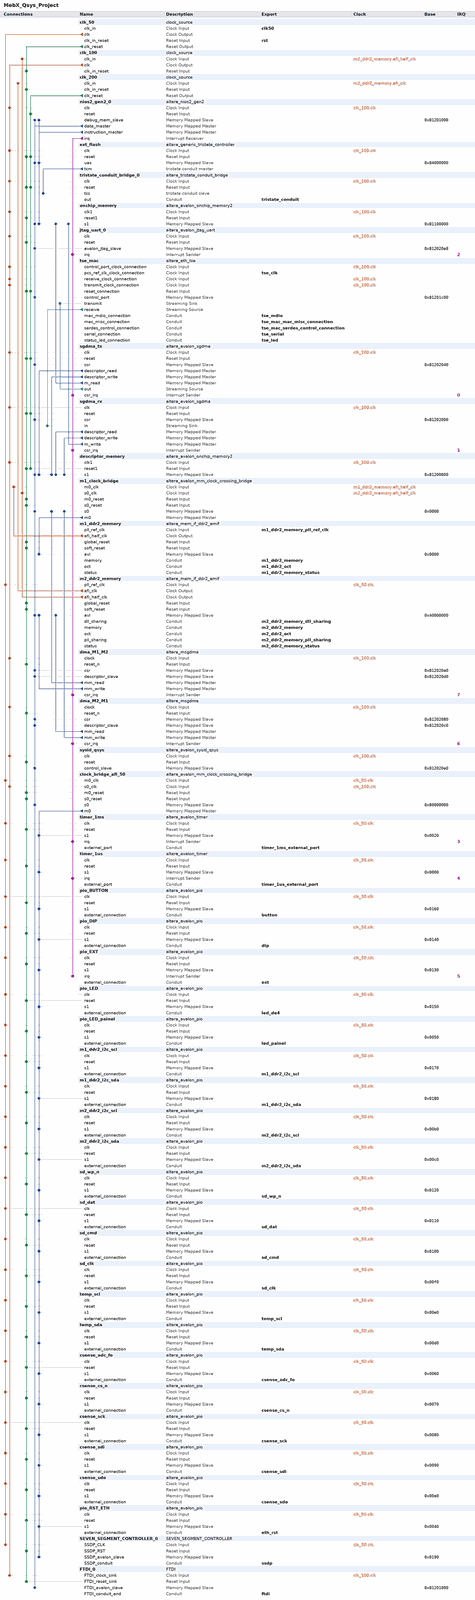
[diagram p0: system contents, whole]
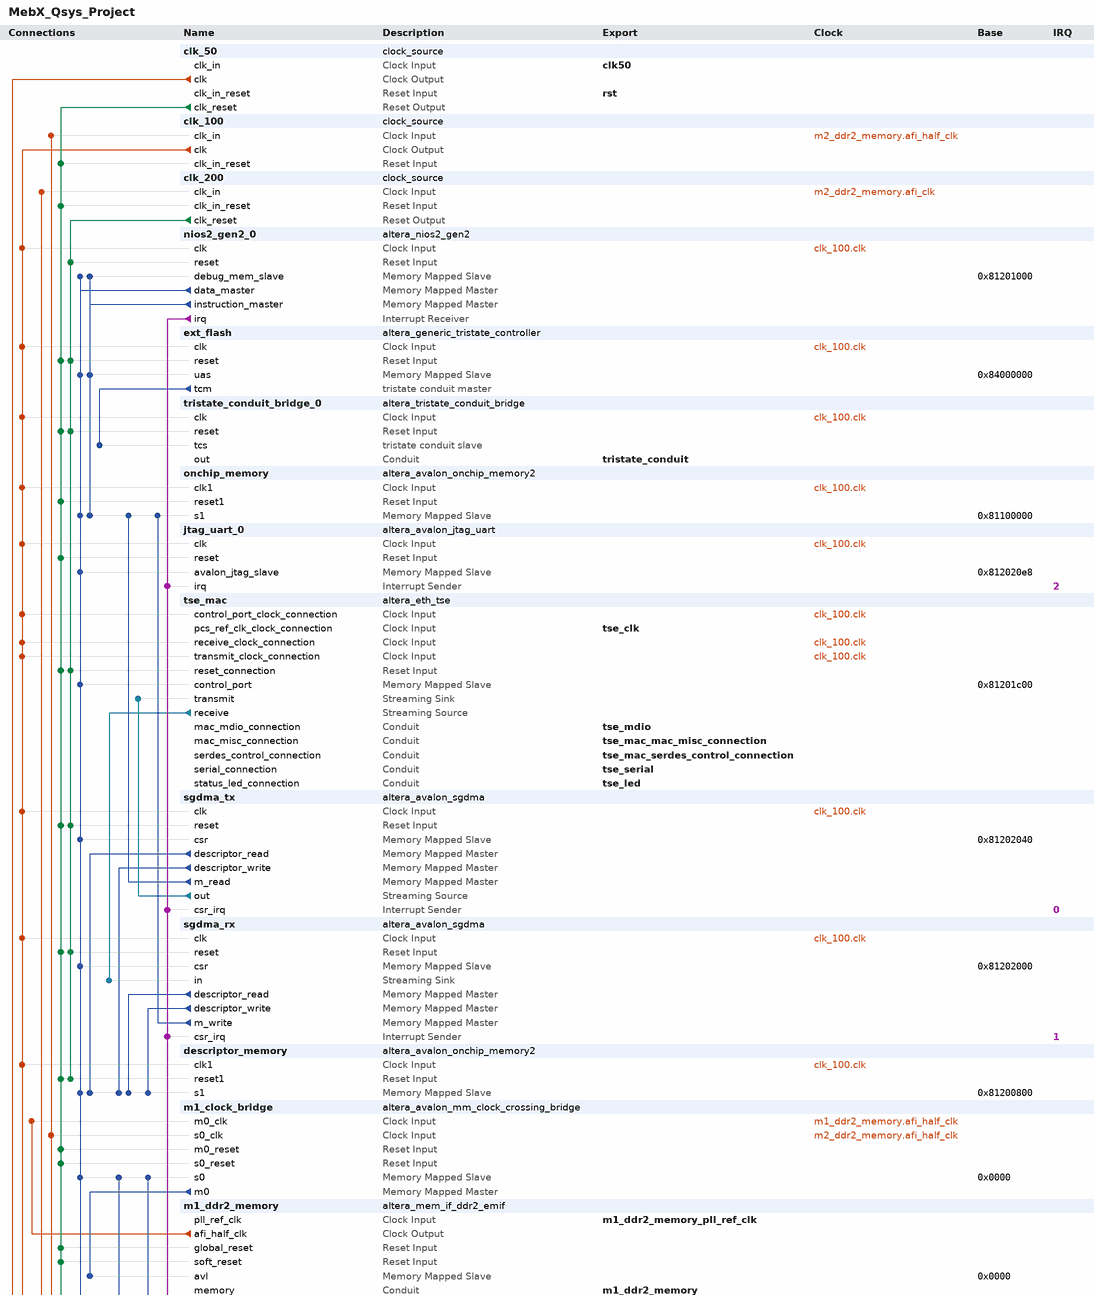
[diagram p1: system contents, upper part]
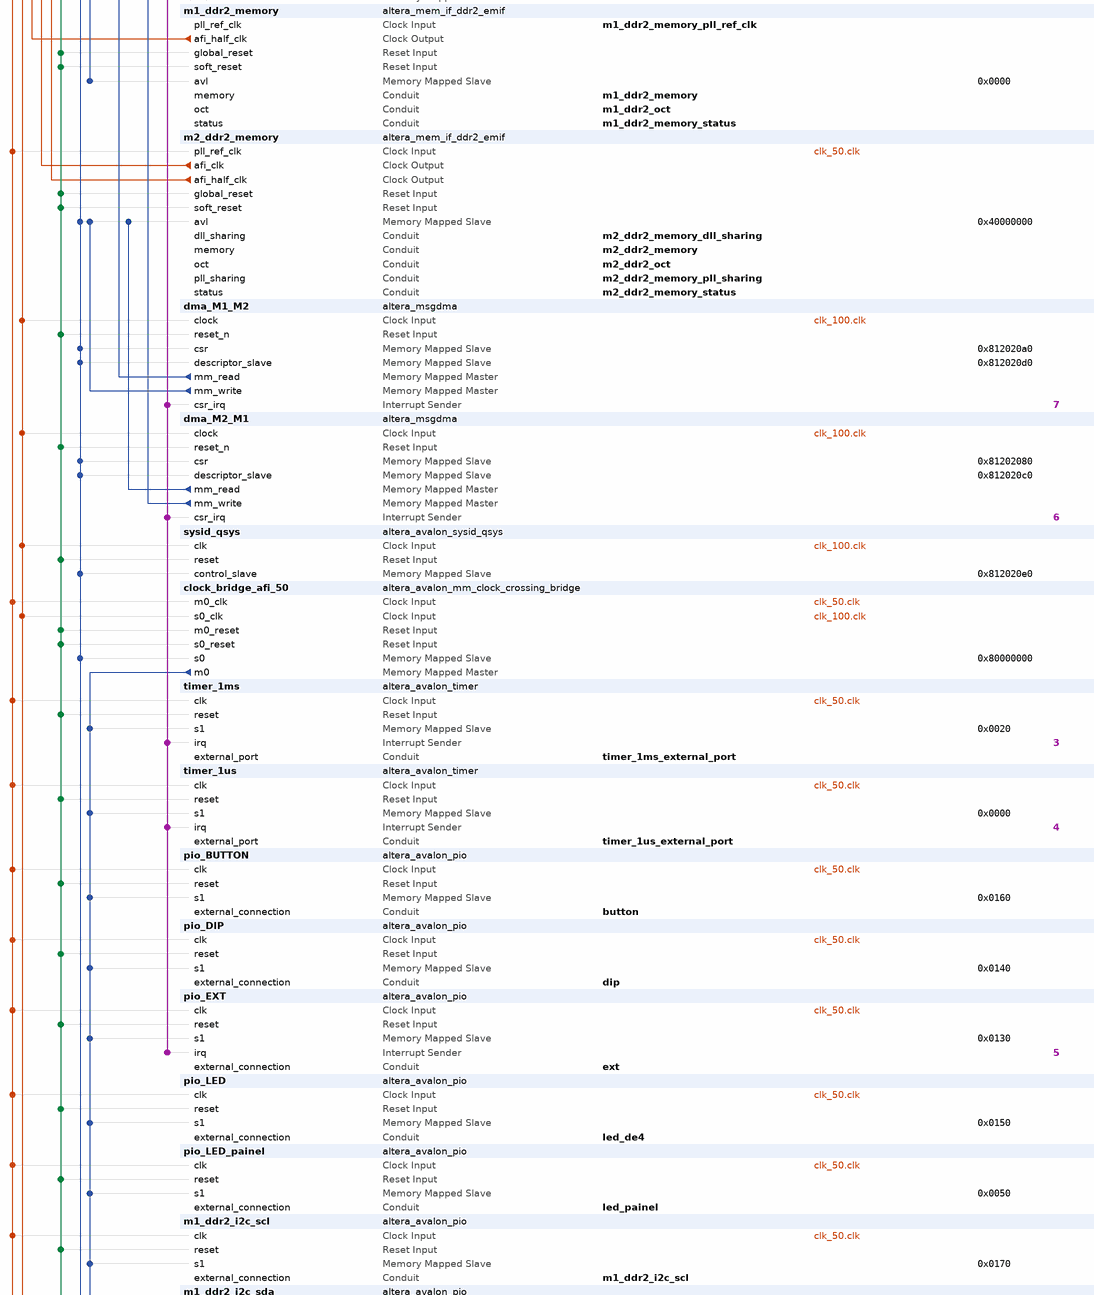
[diagram p2: system contents, middle part]
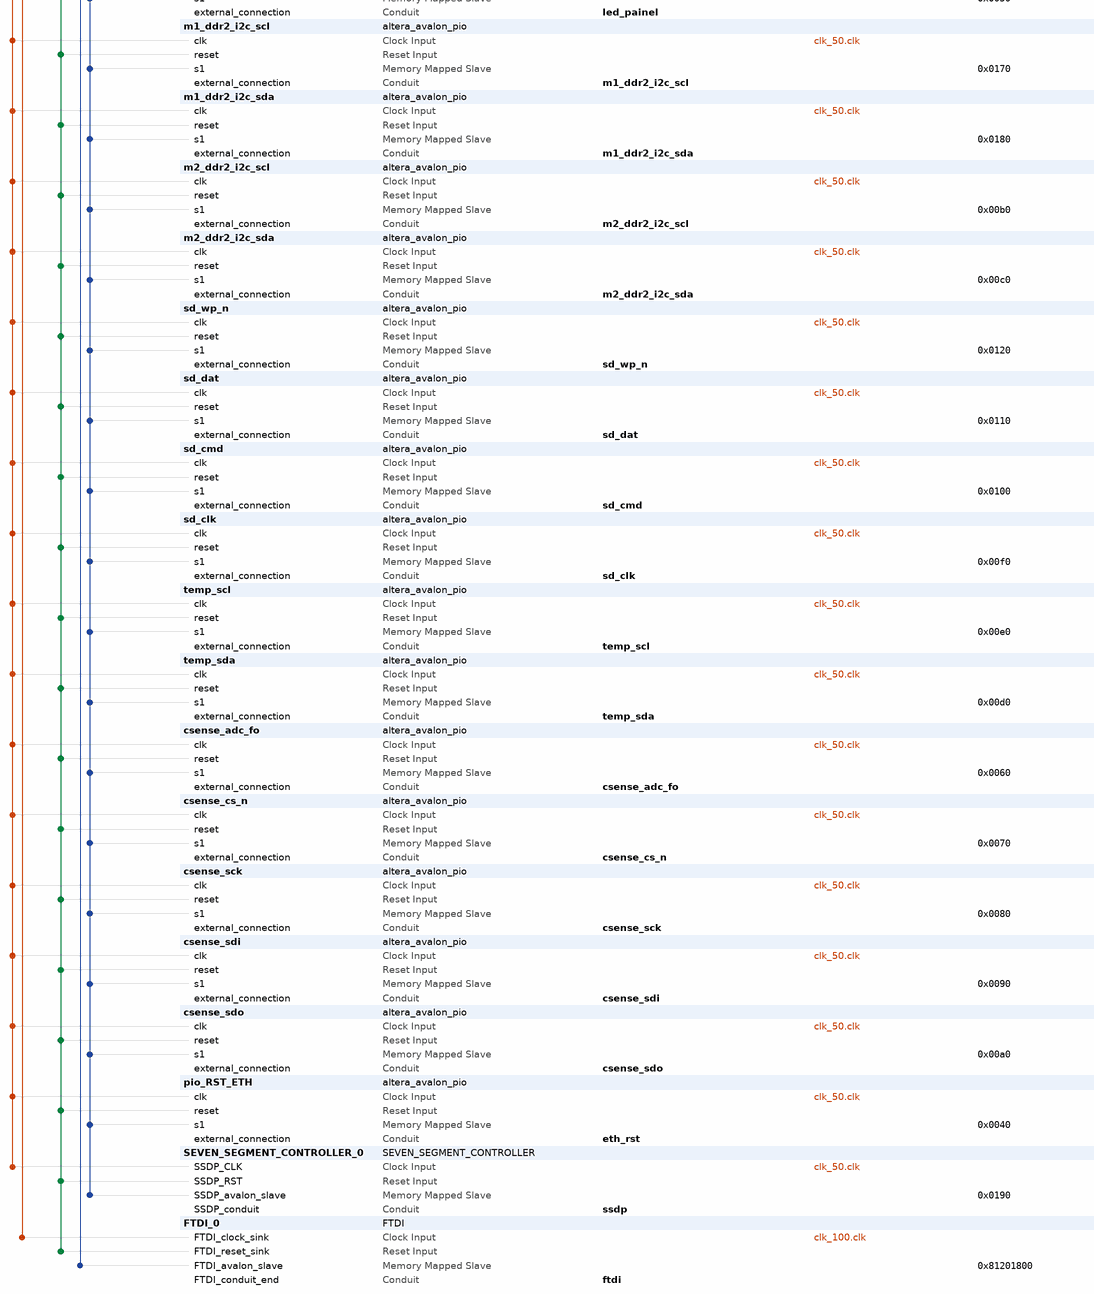
[diagram p3: system contents, lower part]
# Platform Designer (Qsys) system MebX_Qsys_Project, Stratix IV EP4SGX230KF40C2
# Parameters at their usual value, and those the tool derives, are not listed.
package require -exact qsys 16.1
create_system MebX_Qsys_Project
set_project_property DEVICE_FAMILY {Stratix IV}
set_project_property DEVICE EP4SGX230KF40C2

add_instance clk_50 clock_source 16.1
set_instance_parameter_value clk_50 clockFrequency 50000000

add_instance clk_100 clock_source 16.1
set_instance_parameter_value clk_100 clockFrequency 100000000

add_instance clk_200 clock_source 16.1
set_instance_parameter_value clk_200 clockFrequency 200000000

add_instance nios2_gen2_0 altera_nios2_gen2 16.1
set_instance_parameter_value nios2_gen2_0 dcache_size 0
set_instance_parameter_value nios2_gen2_0 debug_hwbreakpoint 2
set_instance_parameter_value nios2_gen2_0 dividerType srt2
set_instance_parameter_value nios2_gen2_0 exceptionSlave onchip_memory.s1
set_instance_parameter_value nios2_gen2_0 icache_burstType Sequential
set_instance_parameter_value nios2_gen2_0 icache_size 4096
set_instance_parameter_value nios2_gen2_0 impl Fast
set_instance_parameter_value nios2_gen2_0 mul_64_impl 1
set_instance_parameter_value nios2_gen2_0 mul_shift_choice 1
set_instance_parameter_value nios2_gen2_0 resetOffset 33685504
set_instance_parameter_value nios2_gen2_0 resetSlave ext_flash.uas
set_instance_parameter_value nios2_gen2_0 setting_support31bitdcachebypass false

add_instance ext_flash altera_generic_tristate_controller 16.1
set_instance_parameter_value ext_flash ACTIVE_LOW_BEGINTRANSFER 0
set_instance_parameter_value ext_flash ACTIVE_LOW_BYTEENABLE 0
set_instance_parameter_value ext_flash ACTIVE_LOW_OUTPUTENABLE 0
set_instance_parameter_value ext_flash ACTIVE_LOW_READ 1
set_instance_parameter_value ext_flash CHIPSELECT_THROUGH_READLATENCY 0
set_instance_parameter_value ext_flash INTERFACE_ASSIGNMENT_KEYS embeddedsw.configuration.isFlash,embeddedsw.configuration.isNonVolatileStorage,embeddedsw.configuration.isMemoryDevice
set_instance_parameter_value ext_flash INTERFACE_ASSIGNMENT_VALUES 1,1,1
set_instance_parameter_value ext_flash MODULE_ASSIGNMENT_KEYS embeddedsw.configuration.hwClassnameDriverSupportList,embeddedsw.configuration.hwClassnameDriverSupportDefault,embeddedsw.CMacro.SETUP_VALUE,embeddedsw.CMacro.WAIT_VALUE,embeddedsw.CMacro.HOLD_VALUE,embeddedsw.CMacro.TIMING_UNITS,embeddedsw.CMacro.SIZE,embeddedsw.memoryInfo.MEM_INIT_DATA_WIDTH,embeddedsw.memoryInfo.HAS_BYTE_LANE,embeddedsw.memoryInfo.IS_FLASH,embeddedsw.memoryInfo.GENERATE_DAT_SYM,embeddedsw.memoryInfo.GENERATE_FLASH,embeddedsw.memoryInfo.DAT_SYM_INSTALL_DIR,embeddedsw.memoryInfo.FLASH_INSTALL_DIR
set_instance_parameter_value ext_flash MODULE_ASSIGNMENT_VALUES "altera_avalon_lan91c111\\,altera_avalon_cfi_flash,altera_avalon_cfi_flash,25,100,20,\"ns\",33554432u,16,1,1,1,1,SIM_DIR,APP_DIR"
set_instance_parameter_value ext_flash TCM_ADDRESS_W 26
set_instance_parameter_value ext_flash TCM_BYTEENABLE_W 2
set_instance_parameter_value ext_flash TCM_DATA_HOLD 20
set_instance_parameter_value ext_flash TCM_DATA_W 16
set_instance_parameter_value ext_flash TCM_MAX_PENDING_READ_TRANSACTIONS 3
set_instance_parameter_value ext_flash TCM_READLATENCY 2
set_instance_parameter_value ext_flash TCM_READ_WAIT 100
set_instance_parameter_value ext_flash TCM_SETUP_WAIT 25
set_instance_parameter_value ext_flash TCM_SYMBOLS_PER_WORD 2
set_instance_parameter_value ext_flash TCM_TIMING_UNITS 0
set_instance_parameter_value ext_flash TCM_TURNAROUND_TIME 2
set_instance_parameter_value ext_flash TCM_WRITE_WAIT 100
set_instance_parameter_value ext_flash USE_BEGINTRANSFER 0
set_instance_parameter_value ext_flash USE_BYTEENABLE 0
set_instance_parameter_value ext_flash USE_OUTPUTENABLE 0
set_instance_parameter_value ext_flash USE_READ 1

add_instance tristate_conduit_bridge_0 altera_tristate_conduit_bridge 16.1

add_instance onchip_memory altera_avalon_onchip_memory2 16.1
set_instance_parameter_value onchip_memory blockType M9K
set_instance_parameter_value onchip_memory dataWidth 32
set_instance_parameter_value onchip_memory dualPort false
set_instance_parameter_value onchip_memory initMemContent false
set_instance_parameter_value onchip_memory initializationFileName onchip_mem.hex
set_instance_parameter_value onchip_memory memorySize 1024000

add_instance jtag_uart_0 altera_avalon_jtag_uart 16.1
set_instance_parameter_value jtag_uart_0 simInteractiveOptions NO_INTERACTIVE_WINDOWS

add_instance tse_mac altera_eth_tse 16.1
set_instance_parameter_value tse_mac core_variation MAC_PCS
set_instance_parameter_value tse_mac ena_hash true
set_instance_parameter_value tse_mac enable_hd_logic true
set_instance_parameter_value tse_mac enable_mac_flow_ctrl true
set_instance_parameter_value tse_mac enable_mac_vlan true
set_instance_parameter_value tse_mac enable_magic_detect true
set_instance_parameter_value tse_mac enable_sgmii true
set_instance_parameter_value tse_mac enable_shift16 true
set_instance_parameter_value tse_mac enable_sup_addr true
set_instance_parameter_value tse_mac ifGMII MII_GMII
set_instance_parameter_value tse_mac ing_addr 11
set_instance_parameter_value tse_mac mdio_clk_div 40
set_instance_parameter_value tse_mac stat_cnt_ena true
set_instance_parameter_value tse_mac transceiver_type LVDS_IO

add_instance sgdma_tx altera_avalon_sgdma 16.1
set_instance_parameter_value sgdma_tx enableBurstTransfers false
set_instance_parameter_value sgdma_tx enableUnalignedTransfers false
set_instance_parameter_value sgdma_tx readBlockDataWidth 32
set_instance_parameter_value sgdma_tx sinkErrorWidth 0
set_instance_parameter_value sgdma_tx sourceErrorWidth 0
set_instance_parameter_value sgdma_tx transferMode MEMORY_TO_STREAM
set_instance_parameter_value sgdma_tx writeBurstcountWidth 4

add_instance sgdma_rx altera_avalon_sgdma 16.1
set_instance_parameter_value sgdma_rx enableBurstTransfers false
set_instance_parameter_value sgdma_rx enableUnalignedTransfers false
set_instance_parameter_value sgdma_rx readBlockDataWidth 32
set_instance_parameter_value sgdma_rx sinkErrorWidth 0
set_instance_parameter_value sgdma_rx sourceErrorWidth 0
set_instance_parameter_value sgdma_rx transferMode STREAM_TO_MEMORY
set_instance_parameter_value sgdma_rx writeBurstcountWidth 4

add_instance descriptor_memory altera_avalon_onchip_memory2 16.1
set_instance_parameter_value descriptor_memory dataWidth 32
set_instance_parameter_value descriptor_memory dualPort false
set_instance_parameter_value descriptor_memory initMemContent true
set_instance_parameter_value descriptor_memory initializationFileName onchip_mem.hex
set_instance_parameter_value descriptor_memory memorySize 2048

add_instance m1_clock_bridge altera_avalon_mm_clock_crossing_bridge 16.1
set_instance_parameter_value m1_clock_bridge ADDRESS_WIDTH 31
set_instance_parameter_value m1_clock_bridge COMMAND_FIFO_DEPTH 4
set_instance_parameter_value m1_clock_bridge DATA_WIDTH 32
set_instance_parameter_value m1_clock_bridge MASTER_SYNC_DEPTH 2
set_instance_parameter_value m1_clock_bridge MAX_BURST_SIZE 128
set_instance_parameter_value m1_clock_bridge RESPONSE_FIFO_DEPTH 256
set_instance_parameter_value m1_clock_bridge SLAVE_SYNC_DEPTH 2
set_instance_parameter_value m1_clock_bridge USE_AUTO_ADDRESS_WIDTH 1

add_instance m1_ddr2_memory altera_mem_if_ddr2_emif 16.1
set_instance_parameter_value m1_ddr2_memory AVL_MAX_SIZE 4
set_instance_parameter_value m1_ddr2_memory CALIBRATION_MODE Full
set_instance_parameter_value m1_ddr2_memory DLL_SHARING_MODE None
set_instance_parameter_value m1_ddr2_memory EXPORT_AFI_HALF_CLK true
set_instance_parameter_value m1_ddr2_memory MEM_BANKADDR_WIDTH 3
set_instance_parameter_value m1_ddr2_memory MEM_CLK_FREQ 400.0
set_instance_parameter_value m1_ddr2_memory MEM_COL_ADDR_WIDTH 10
set_instance_parameter_value m1_ddr2_memory MEM_DQ_WIDTH 64
set_instance_parameter_value m1_ddr2_memory MEM_NUMBER_OF_RANKS_PER_DIMM 1
set_instance_parameter_value m1_ddr2_memory MEM_ROW_ADDR_WIDTH 14
set_instance_parameter_value m1_ddr2_memory MEM_TCL 6
set_instance_parameter_value m1_ddr2_memory MEM_TRAS_NS 40.0
set_instance_parameter_value m1_ddr2_memory PLL_SHARING_MODE None
set_instance_parameter_value m1_ddr2_memory POWER_OF_TWO_BUS true
set_instance_parameter_value m1_ddr2_memory REF_CLK_FREQ 50.0
set_instance_parameter_value m1_ddr2_memory TIMING_TDQSQ 200
set_instance_parameter_value m1_ddr2_memory TIMING_TIH 375
set_instance_parameter_value m1_ddr2_memory TIMING_TQHS 300
set_instance_parameter_value m1_ddr2_memory USER_DEBUG_LEVEL 0

add_instance m2_ddr2_memory altera_mem_if_ddr2_emif 16.1
set_instance_parameter_value m2_ddr2_memory AVL_MAX_SIZE 4
set_instance_parameter_value m2_ddr2_memory CALIBRATION_MODE Full
set_instance_parameter_value m2_ddr2_memory DLL_SHARING_MODE Master
set_instance_parameter_value m2_ddr2_memory EXPORT_AFI_HALF_CLK true
set_instance_parameter_value m2_ddr2_memory MEM_BANKADDR_WIDTH 3
set_instance_parameter_value m2_ddr2_memory MEM_CLK_FREQ 400.0
set_instance_parameter_value m2_ddr2_memory MEM_COL_ADDR_WIDTH 10
set_instance_parameter_value m2_ddr2_memory MEM_DQ_WIDTH 64
set_instance_parameter_value m2_ddr2_memory MEM_NUMBER_OF_RANKS_PER_DIMM 1
set_instance_parameter_value m2_ddr2_memory MEM_ROW_ADDR_WIDTH 14
set_instance_parameter_value m2_ddr2_memory MEM_TCL 6
set_instance_parameter_value m2_ddr2_memory MEM_TRAS_NS 40.0
set_instance_parameter_value m2_ddr2_memory PLL_SHARING_MODE Master
set_instance_parameter_value m2_ddr2_memory POWER_OF_TWO_BUS true
set_instance_parameter_value m2_ddr2_memory REF_CLK_FREQ 50.0
set_instance_parameter_value m2_ddr2_memory TIMING_TDQSQ 200
set_instance_parameter_value m2_ddr2_memory TIMING_TIH 375
set_instance_parameter_value m2_ddr2_memory TIMING_TQHS 300
set_instance_parameter_value m2_ddr2_memory USER_DEBUG_LEVEL 0

add_instance dma_M1_M2 altera_msgdma 16.1
set_instance_parameter_value dma_M1_M2 BURST_ENABLE 1
set_instance_parameter_value dma_M1_M2 DATA_FIFO_DEPTH 512
set_instance_parameter_value dma_M1_M2 DATA_WIDTH 32
set_instance_parameter_value dma_M1_M2 DESCRIPTOR_FIFO_DEPTH 32
set_instance_parameter_value dma_M1_M2 ENHANCED_FEATURES 0
set_instance_parameter_value dma_M1_M2 ERROR_ENABLE 0
set_instance_parameter_value dma_M1_M2 MAX_BURST_COUNT 128
set_instance_parameter_value dma_M1_M2 MAX_BYTE 67108864
set_instance_parameter_value dma_M1_M2 MODE 0
set_instance_parameter_value dma_M1_M2 PACKET_ENABLE 0
set_instance_parameter_value dma_M1_M2 TRANSFER_TYPE {Aligned Accesses}

add_instance dma_M2_M1 altera_msgdma 16.1
set_instance_parameter_value dma_M2_M1 BURST_ENABLE 1
set_instance_parameter_value dma_M2_M1 DATA_FIFO_DEPTH 512
set_instance_parameter_value dma_M2_M1 DATA_WIDTH 32
set_instance_parameter_value dma_M2_M1 DESCRIPTOR_FIFO_DEPTH 32
set_instance_parameter_value dma_M2_M1 ENHANCED_FEATURES 0
set_instance_parameter_value dma_M2_M1 ERROR_ENABLE 0
set_instance_parameter_value dma_M2_M1 MAX_BURST_COUNT 128
set_instance_parameter_value dma_M2_M1 MAX_BYTE 67108864
set_instance_parameter_value dma_M2_M1 MODE 0
set_instance_parameter_value dma_M2_M1 PACKET_ENABLE 0
set_instance_parameter_value dma_M2_M1 TRANSFER_TYPE {Aligned Accesses}

add_instance sysid_qsys altera_avalon_sysid_qsys 16.1
set_instance_parameter_value sysid_qsys id 0

add_instance clock_bridge_afi_50 altera_avalon_mm_clock_crossing_bridge 16.1
set_instance_parameter_value clock_bridge_afi_50 ADDRESS_WIDTH 32
set_instance_parameter_value clock_bridge_afi_50 COMMAND_FIFO_DEPTH 4
set_instance_parameter_value clock_bridge_afi_50 DATA_WIDTH 32
set_instance_parameter_value clock_bridge_afi_50 MASTER_SYNC_DEPTH 2
set_instance_parameter_value clock_bridge_afi_50 MAX_BURST_SIZE 1
set_instance_parameter_value clock_bridge_afi_50 RESPONSE_FIFO_DEPTH 4
set_instance_parameter_value clock_bridge_afi_50 SLAVE_SYNC_DEPTH 2
set_instance_parameter_value clock_bridge_afi_50 USE_AUTO_ADDRESS_WIDTH 1

add_instance timer_1ms altera_avalon_timer 16.1
set_instance_parameter_value timer_1ms alwaysRun true
set_instance_parameter_value timer_1ms period 1
set_instance_parameter_value timer_1ms periodUnits MSEC
set_instance_parameter_value timer_1ms timeoutPulseOutput true

add_instance timer_1us altera_avalon_timer 16.1
set_instance_parameter_value timer_1us alwaysRun true
set_instance_parameter_value timer_1us period 1
set_instance_parameter_value timer_1us periodUnits USEC
set_instance_parameter_value timer_1us timeoutPulseOutput true

add_instance pio_BUTTON altera_avalon_pio 16.1
set_instance_parameter_value pio_BUTTON direction Input
set_instance_parameter_value pio_BUTTON width 4

add_instance pio_DIP altera_avalon_pio 16.1
set_instance_parameter_value pio_DIP direction Input
set_instance_parameter_value pio_DIP width 8

add_instance pio_EXT altera_avalon_pio 16.1
set_instance_parameter_value pio_EXT bitClearingEdgeCapReg true
set_instance_parameter_value pio_EXT captureEdge true
set_instance_parameter_value pio_EXT direction Input
set_instance_parameter_value pio_EXT generateIRQ true
set_instance_parameter_value pio_EXT width 1

add_instance pio_LED altera_avalon_pio 16.1
set_instance_parameter_value pio_LED direction Output
set_instance_parameter_value pio_LED width 8

add_instance pio_LED_painel altera_avalon_pio 16.1
set_instance_parameter_value pio_LED_painel direction Output
set_instance_parameter_value pio_LED_painel width 13

add_instance m1_ddr2_i2c_scl altera_avalon_pio 16.1
set_instance_parameter_value m1_ddr2_i2c_scl direction Output
set_instance_parameter_value m1_ddr2_i2c_scl width 1

add_instance m1_ddr2_i2c_sda altera_avalon_pio 16.1
set_instance_parameter_value m1_ddr2_i2c_sda direction Bidir
set_instance_parameter_value m1_ddr2_i2c_sda width 1

add_instance m2_ddr2_i2c_scl altera_avalon_pio 16.1
set_instance_parameter_value m2_ddr2_i2c_scl direction Output
set_instance_parameter_value m2_ddr2_i2c_scl width 1

add_instance m2_ddr2_i2c_sda altera_avalon_pio 16.1
set_instance_parameter_value m2_ddr2_i2c_sda direction Bidir
set_instance_parameter_value m2_ddr2_i2c_sda width 1

add_instance sd_wp_n altera_avalon_pio 16.1
set_instance_parameter_value sd_wp_n direction Input
set_instance_parameter_value sd_wp_n width 1

add_instance sd_dat altera_avalon_pio 16.1
set_instance_parameter_value sd_dat direction Bidir
set_instance_parameter_value sd_dat width 4

add_instance sd_cmd altera_avalon_pio 16.1
set_instance_parameter_value sd_cmd direction Bidir
set_instance_parameter_value sd_cmd width 1

add_instance sd_clk altera_avalon_pio 16.1
set_instance_parameter_value sd_clk direction Output
set_instance_parameter_value sd_clk width 1

add_instance temp_scl altera_avalon_pio 16.1
set_instance_parameter_value temp_scl direction Output
set_instance_parameter_value temp_scl width 1

add_instance temp_sda altera_avalon_pio 16.1
set_instance_parameter_value temp_sda direction Bidir
set_instance_parameter_value temp_sda width 1

add_instance csense_adc_fo altera_avalon_pio 16.1
set_instance_parameter_value csense_adc_fo direction Output
set_instance_parameter_value csense_adc_fo width 1

add_instance csense_cs_n altera_avalon_pio 16.1
set_instance_parameter_value csense_cs_n direction Output
set_instance_parameter_value csense_cs_n width 2

add_instance csense_sck altera_avalon_pio 16.1
set_instance_parameter_value csense_sck direction Output
set_instance_parameter_value csense_sck width 1

add_instance csense_sdi altera_avalon_pio 16.1
set_instance_parameter_value csense_sdi direction Output
set_instance_parameter_value csense_sdi width 1

add_instance csense_sdo altera_avalon_pio 16.1
set_instance_parameter_value csense_sdo direction Input
set_instance_parameter_value csense_sdo width 1

add_instance pio_RST_ETH altera_avalon_pio 16.1
set_instance_parameter_value pio_RST_ETH direction Output
set_instance_parameter_value pio_RST_ETH width 1

add_instance SEVEN_SEGMENT_CONTROLLER_0 SEVEN_SEGMENT_CONTROLLER 1.0

add_instance FTDI_0 FTDI 1.0

# connections
add_connection clk_50.clk clock_bridge_afi_50.m0_clk clock
add_connection clk_50.clk csense_adc_fo.clk clock
add_connection clk_50.clk csense_cs_n.clk clock
add_connection clk_50.clk csense_sck.clk clock
add_connection clk_50.clk csense_sdi.clk clock
add_connection clk_50.clk csense_sdo.clk clock
add_connection clk_50.clk m1_ddr2_i2c_scl.clk clock
add_connection clk_50.clk m1_ddr2_i2c_sda.clk clock
add_connection clk_50.clk m2_ddr2_i2c_scl.clk clock
add_connection clk_50.clk m2_ddr2_i2c_sda.clk clock
add_connection clk_50.clk m2_ddr2_memory.pll_ref_clk clock
add_connection clk_50.clk pio_BUTTON.clk clock
add_connection clk_50.clk pio_DIP.clk clock
add_connection clk_50.clk pio_EXT.clk clock
add_connection clk_50.clk pio_LED.clk clock
add_connection clk_50.clk pio_LED_painel.clk clock
add_connection clk_50.clk pio_RST_ETH.clk clock
add_connection clk_50.clk sd_clk.clk clock
add_connection clk_50.clk sd_cmd.clk clock
add_connection clk_50.clk sd_dat.clk clock
add_connection clk_50.clk sd_wp_n.clk clock
add_connection clk_50.clk SEVEN_SEGMENT_CONTROLLER_0.SSDP_CLK clock
add_connection clk_50.clk temp_scl.clk clock
add_connection clk_50.clk temp_sda.clk clock
add_connection clk_50.clk timer_1ms.clk clock
add_connection clk_50.clk timer_1us.clk clock
add_connection clk_100.clk clock_bridge_afi_50.s0_clk clock
add_connection clk_100.clk descriptor_memory.clk1 clock
add_connection clk_100.clk dma_M1_M2.clock clock
add_connection clk_100.clk dma_M2_M1.clock clock
add_connection clk_100.clk ext_flash.clk clock
add_connection clk_100.clk FTDI_0.FTDI_clock_sink clock
add_connection clk_100.clk jtag_uart_0.clk clock
add_connection clk_100.clk nios2_gen2_0.clk clock
add_connection clk_100.clk onchip_memory.clk1 clock
add_connection clk_100.clk sgdma_rx.clk clock
add_connection clk_100.clk sgdma_tx.clk clock
add_connection clk_100.clk sysid_qsys.clk clock
add_connection clk_100.clk tristate_conduit_bridge_0.clk clock
add_connection clk_100.clk tse_mac.control_port_clock_connection clock
add_connection clk_100.clk tse_mac.receive_clock_connection clock
add_connection clk_100.clk tse_mac.transmit_clock_connection clock
add_connection m1_ddr2_memory.afi_half_clk m1_clock_bridge.m0_clk clock
add_connection m2_ddr2_memory.afi_clk clk_200.clk_in clock
add_connection m2_ddr2_memory.afi_half_clk clk_100.clk_in clock
add_connection m2_ddr2_memory.afi_half_clk m1_clock_bridge.s0_clk clock
add_connection clk_50.clk_reset clk_100.clk_in_reset reset
add_connection clk_50.clk_reset clk_200.clk_in_reset reset
add_connection clk_50.clk_reset clock_bridge_afi_50.m0_reset reset
add_connection clk_50.clk_reset clock_bridge_afi_50.s0_reset reset
add_connection clk_50.clk_reset csense_adc_fo.reset reset
add_connection clk_50.clk_reset csense_cs_n.reset reset
add_connection clk_50.clk_reset csense_sck.reset reset
add_connection clk_50.clk_reset csense_sdi.reset reset
add_connection clk_50.clk_reset csense_sdo.reset reset
add_connection clk_50.clk_reset descriptor_memory.reset1 reset
add_connection clk_50.clk_reset dma_M1_M2.reset_n reset
add_connection clk_50.clk_reset dma_M2_M1.reset_n reset
add_connection clk_50.clk_reset ext_flash.reset reset
add_connection clk_50.clk_reset FTDI_0.FTDI_reset_sink reset
add_connection clk_50.clk_reset jtag_uart_0.reset reset
add_connection clk_50.clk_reset m1_clock_bridge.m0_reset reset
add_connection clk_50.clk_reset m1_clock_bridge.s0_reset reset
add_connection clk_50.clk_reset m1_ddr2_i2c_scl.reset reset
add_connection clk_50.clk_reset m1_ddr2_i2c_sda.reset reset
add_connection clk_50.clk_reset m1_ddr2_memory.global_reset reset
add_connection clk_50.clk_reset m1_ddr2_memory.soft_reset reset
add_connection clk_50.clk_reset m2_ddr2_i2c_scl.reset reset
add_connection clk_50.clk_reset m2_ddr2_i2c_sda.reset reset
add_connection clk_50.clk_reset m2_ddr2_memory.global_reset reset
add_connection clk_50.clk_reset m2_ddr2_memory.soft_reset reset
add_connection clk_50.clk_reset onchip_memory.reset1 reset
add_connection clk_50.clk_reset pio_BUTTON.reset reset
add_connection clk_50.clk_reset pio_DIP.reset reset
add_connection clk_50.clk_reset pio_EXT.reset reset
add_connection clk_50.clk_reset pio_LED.reset reset
add_connection clk_50.clk_reset pio_LED_painel.reset reset
add_connection clk_50.clk_reset pio_RST_ETH.reset reset
add_connection clk_50.clk_reset sd_clk.reset reset
add_connection clk_50.clk_reset sd_cmd.reset reset
add_connection clk_50.clk_reset sd_dat.reset reset
add_connection clk_50.clk_reset sd_wp_n.reset reset
add_connection clk_50.clk_reset SEVEN_SEGMENT_CONTROLLER_0.SSDP_RST reset
add_connection clk_50.clk_reset sgdma_rx.reset reset
add_connection clk_50.clk_reset sgdma_tx.reset reset
add_connection clk_50.clk_reset sysid_qsys.reset reset
add_connection clk_50.clk_reset temp_scl.reset reset
add_connection clk_50.clk_reset temp_sda.reset reset
add_connection clk_50.clk_reset timer_1ms.reset reset
add_connection clk_50.clk_reset timer_1us.reset reset
add_connection clk_50.clk_reset tristate_conduit_bridge_0.reset reset
add_connection clk_50.clk_reset tse_mac.reset_connection reset
add_connection clk_200.clk_reset descriptor_memory.reset1 reset
add_connection clk_200.clk_reset ext_flash.reset reset
add_connection clk_200.clk_reset nios2_gen2_0.reset reset
add_connection clk_200.clk_reset sgdma_rx.reset reset
add_connection clk_200.clk_reset sgdma_tx.reset reset
add_connection clk_200.clk_reset tristate_conduit_bridge_0.reset reset
add_connection clk_200.clk_reset tse_mac.reset_connection reset
add_connection clock_bridge_afi_50.m0 csense_adc_fo.s1 avalon
set_connection_parameter_value clock_bridge_afi_50.m0/csense_adc_fo.s1 baseAddress 0x0060
add_connection clock_bridge_afi_50.m0 csense_cs_n.s1 avalon
set_connection_parameter_value clock_bridge_afi_50.m0/csense_cs_n.s1 baseAddress 0x0070
add_connection clock_bridge_afi_50.m0 csense_sck.s1 avalon
set_connection_parameter_value clock_bridge_afi_50.m0/csense_sck.s1 baseAddress 0x0080
add_connection clock_bridge_afi_50.m0 csense_sdi.s1 avalon
set_connection_parameter_value clock_bridge_afi_50.m0/csense_sdi.s1 baseAddress 0x0090
add_connection clock_bridge_afi_50.m0 csense_sdo.s1 avalon
set_connection_parameter_value clock_bridge_afi_50.m0/csense_sdo.s1 baseAddress 0x00a0
add_connection clock_bridge_afi_50.m0 m1_ddr2_i2c_scl.s1 avalon
set_connection_parameter_value clock_bridge_afi_50.m0/m1_ddr2_i2c_scl.s1 baseAddress 0x0170
add_connection clock_bridge_afi_50.m0 m1_ddr2_i2c_sda.s1 avalon
set_connection_parameter_value clock_bridge_afi_50.m0/m1_ddr2_i2c_sda.s1 baseAddress 0x0180
add_connection clock_bridge_afi_50.m0 m2_ddr2_i2c_scl.s1 avalon
set_connection_parameter_value clock_bridge_afi_50.m0/m2_ddr2_i2c_scl.s1 baseAddress 0x00b0
add_connection clock_bridge_afi_50.m0 m2_ddr2_i2c_sda.s1 avalon
set_connection_parameter_value clock_bridge_afi_50.m0/m2_ddr2_i2c_sda.s1 baseAddress 0x00c0
add_connection clock_bridge_afi_50.m0 pio_BUTTON.s1 avalon
set_connection_parameter_value clock_bridge_afi_50.m0/pio_BUTTON.s1 baseAddress 0x0160
add_connection clock_bridge_afi_50.m0 pio_DIP.s1 avalon
set_connection_parameter_value clock_bridge_afi_50.m0/pio_DIP.s1 baseAddress 0x0140
add_connection clock_bridge_afi_50.m0 pio_EXT.s1 avalon
set_connection_parameter_value clock_bridge_afi_50.m0/pio_EXT.s1 baseAddress 0x0130
add_connection clock_bridge_afi_50.m0 pio_LED.s1 avalon
set_connection_parameter_value clock_bridge_afi_50.m0/pio_LED.s1 baseAddress 0x0150
add_connection clock_bridge_afi_50.m0 pio_LED_painel.s1 avalon
set_connection_parameter_value clock_bridge_afi_50.m0/pio_LED_painel.s1 baseAddress 0x0050
add_connection clock_bridge_afi_50.m0 pio_RST_ETH.s1 avalon
set_connection_parameter_value clock_bridge_afi_50.m0/pio_RST_ETH.s1 baseAddress 0x0040
add_connection clock_bridge_afi_50.m0 sd_clk.s1 avalon
set_connection_parameter_value clock_bridge_afi_50.m0/sd_clk.s1 baseAddress 0x00f0
add_connection clock_bridge_afi_50.m0 sd_cmd.s1 avalon
set_connection_parameter_value clock_bridge_afi_50.m0/sd_cmd.s1 baseAddress 0x0100
add_connection clock_bridge_afi_50.m0 sd_dat.s1 avalon
set_connection_parameter_value clock_bridge_afi_50.m0/sd_dat.s1 baseAddress 0x0110
add_connection clock_bridge_afi_50.m0 sd_wp_n.s1 avalon
set_connection_parameter_value clock_bridge_afi_50.m0/sd_wp_n.s1 baseAddress 0x0120
add_connection clock_bridge_afi_50.m0 SEVEN_SEGMENT_CONTROLLER_0.SSDP_avalon_slave avalon
set_connection_parameter_value clock_bridge_afi_50.m0/SEVEN_SEGMENT_CONTROLLER_0.SSDP_avalon_slave baseAddress 0x0190
add_connection clock_bridge_afi_50.m0 temp_scl.s1 avalon
set_connection_parameter_value clock_bridge_afi_50.m0/temp_scl.s1 baseAddress 0x00e0
add_connection clock_bridge_afi_50.m0 temp_sda.s1 avalon
set_connection_parameter_value clock_bridge_afi_50.m0/temp_sda.s1 baseAddress 0x00d0
add_connection clock_bridge_afi_50.m0 timer_1ms.s1 avalon
set_connection_parameter_value clock_bridge_afi_50.m0/timer_1ms.s1 baseAddress 0x0020
add_connection clock_bridge_afi_50.m0 timer_1us.s1 avalon
set_connection_parameter_value clock_bridge_afi_50.m0/timer_1us.s1 baseAddress 0x0000
add_connection dma_M1_M2.mm_read m1_clock_bridge.s0 avalon
set_connection_parameter_value dma_M1_M2.mm_read/m1_clock_bridge.s0 baseAddress 0x0000
add_connection dma_M1_M2.mm_write m2_ddr2_memory.avl avalon
set_connection_parameter_value dma_M1_M2.mm_write/m2_ddr2_memory.avl baseAddress 0x40000000
add_connection dma_M2_M1.mm_read m2_ddr2_memory.avl avalon
set_connection_parameter_value dma_M2_M1.mm_read/m2_ddr2_memory.avl baseAddress 0x40000000
add_connection dma_M2_M1.mm_write m1_clock_bridge.s0 avalon
set_connection_parameter_value dma_M2_M1.mm_write/m1_clock_bridge.s0 baseAddress 0x0000
add_connection m1_clock_bridge.m0 m1_ddr2_memory.avl avalon
set_connection_parameter_value m1_clock_bridge.m0/m1_ddr2_memory.avl baseAddress 0x0000
add_connection nios2_gen2_0.data_master clock_bridge_afi_50.s0 avalon
set_connection_parameter_value nios2_gen2_0.data_master/clock_bridge_afi_50.s0 baseAddress 0x80000000
add_connection nios2_gen2_0.data_master descriptor_memory.s1 avalon
set_connection_parameter_value nios2_gen2_0.data_master/descriptor_memory.s1 baseAddress 0x81200800
add_connection nios2_gen2_0.data_master dma_M1_M2.csr avalon
set_connection_parameter_value nios2_gen2_0.data_master/dma_M1_M2.csr baseAddress 0x812020a0
add_connection nios2_gen2_0.data_master dma_M1_M2.descriptor_slave avalon
set_connection_parameter_value nios2_gen2_0.data_master/dma_M1_M2.descriptor_slave baseAddress 0x812020d0
add_connection nios2_gen2_0.data_master dma_M2_M1.csr avalon
set_connection_parameter_value nios2_gen2_0.data_master/dma_M2_M1.csr baseAddress 0x81202080
add_connection nios2_gen2_0.data_master dma_M2_M1.descriptor_slave avalon
set_connection_parameter_value nios2_gen2_0.data_master/dma_M2_M1.descriptor_slave baseAddress 0x812020c0
add_connection nios2_gen2_0.data_master ext_flash.uas avalon
set_connection_parameter_value nios2_gen2_0.data_master/ext_flash.uas baseAddress 0x84000000
add_connection nios2_gen2_0.data_master FTDI_0.FTDI_avalon_slave avalon
set_connection_parameter_value nios2_gen2_0.data_master/FTDI_0.FTDI_avalon_slave baseAddress 0x81201800
add_connection nios2_gen2_0.data_master jtag_uart_0.avalon_jtag_slave avalon
set_connection_parameter_value nios2_gen2_0.data_master/jtag_uart_0.avalon_jtag_slave baseAddress 0x812020e8
add_connection nios2_gen2_0.data_master m1_clock_bridge.s0 avalon
set_connection_parameter_value nios2_gen2_0.data_master/m1_clock_bridge.s0 baseAddress 0x0000
add_connection nios2_gen2_0.data_master m2_ddr2_memory.avl avalon
set_connection_parameter_value nios2_gen2_0.data_master/m2_ddr2_memory.avl baseAddress 0x40000000
add_connection nios2_gen2_0.data_master nios2_gen2_0.debug_mem_slave avalon
set_connection_parameter_value nios2_gen2_0.data_master/nios2_gen2_0.debug_mem_slave baseAddress 0x81201000
add_connection nios2_gen2_0.data_master onchip_memory.s1 avalon
set_connection_parameter_value nios2_gen2_0.data_master/onchip_memory.s1 baseAddress 0x81100000
add_connection nios2_gen2_0.data_master sgdma_rx.csr avalon
set_connection_parameter_value nios2_gen2_0.data_master/sgdma_rx.csr baseAddress 0x81202000
add_connection nios2_gen2_0.data_master sgdma_tx.csr avalon
set_connection_parameter_value nios2_gen2_0.data_master/sgdma_tx.csr baseAddress 0x81202040
add_connection nios2_gen2_0.data_master sysid_qsys.control_slave avalon
set_connection_parameter_value nios2_gen2_0.data_master/sysid_qsys.control_slave baseAddress 0x812020e0
add_connection nios2_gen2_0.data_master tse_mac.control_port avalon
set_connection_parameter_value nios2_gen2_0.data_master/tse_mac.control_port baseAddress 0x81201c00
add_connection nios2_gen2_0.instruction_master ext_flash.uas avalon
set_connection_parameter_value nios2_gen2_0.instruction_master/ext_flash.uas baseAddress 0x84000000
add_connection nios2_gen2_0.instruction_master nios2_gen2_0.debug_mem_slave avalon
set_connection_parameter_value nios2_gen2_0.instruction_master/nios2_gen2_0.debug_mem_slave baseAddress 0x81201000
add_connection nios2_gen2_0.instruction_master onchip_memory.s1 avalon
set_connection_parameter_value nios2_gen2_0.instruction_master/onchip_memory.s1 baseAddress 0x81100000
add_connection sgdma_rx.descriptor_read descriptor_memory.s1 avalon
set_connection_parameter_value sgdma_rx.descriptor_read/descriptor_memory.s1 baseAddress 0x81200800
add_connection sgdma_rx.descriptor_write descriptor_memory.s1 avalon
set_connection_parameter_value sgdma_rx.descriptor_write/descriptor_memory.s1 baseAddress 0x81200800
add_connection sgdma_rx.m_write onchip_memory.s1 avalon
set_connection_parameter_value sgdma_rx.m_write/onchip_memory.s1 baseAddress 0x81100000
add_connection sgdma_tx.descriptor_read descriptor_memory.s1 avalon
set_connection_parameter_value sgdma_tx.descriptor_read/descriptor_memory.s1 baseAddress 0x81200800
add_connection sgdma_tx.descriptor_write descriptor_memory.s1 avalon
set_connection_parameter_value sgdma_tx.descriptor_write/descriptor_memory.s1 baseAddress 0x81200800
add_connection sgdma_tx.m_read onchip_memory.s1 avalon
set_connection_parameter_value sgdma_tx.m_read/onchip_memory.s1 baseAddress 0x81100000
add_connection sgdma_tx.out tse_mac.transmit avalon_streaming
add_connection tse_mac.receive sgdma_rx.in avalon_streaming
add_connection nios2_gen2_0.irq dma_M1_M2.csr_irq interrupt
set_connection_parameter_value nios2_gen2_0.irq/dma_M1_M2.csr_irq irqNumber 7
add_connection nios2_gen2_0.irq dma_M2_M1.csr_irq interrupt
set_connection_parameter_value nios2_gen2_0.irq/dma_M2_M1.csr_irq irqNumber 6
add_connection nios2_gen2_0.irq jtag_uart_0.irq interrupt
set_connection_parameter_value nios2_gen2_0.irq/jtag_uart_0.irq irqNumber 2
add_connection nios2_gen2_0.irq pio_EXT.irq interrupt
set_connection_parameter_value nios2_gen2_0.irq/pio_EXT.irq irqNumber 5
add_connection nios2_gen2_0.irq sgdma_rx.csr_irq interrupt
set_connection_parameter_value nios2_gen2_0.irq/sgdma_rx.csr_irq irqNumber 1
add_connection nios2_gen2_0.irq sgdma_tx.csr_irq interrupt
set_connection_parameter_value nios2_gen2_0.irq/sgdma_tx.csr_irq irqNumber 0
add_connection nios2_gen2_0.irq timer_1ms.irq interrupt
set_connection_parameter_value nios2_gen2_0.irq/timer_1ms.irq irqNumber 3
add_connection nios2_gen2_0.irq timer_1us.irq interrupt
set_connection_parameter_value nios2_gen2_0.irq/timer_1us.irq irqNumber 4
add_connection ext_flash.tcm tristate_conduit_bridge_0.tcs tristate_conduit

# exported interfaces
add_interface button conduit end
set_interface_property button EXPORT_OF pio_BUTTON.external_connection
add_interface clk50 clock sink
set_interface_property clk50 EXPORT_OF clk_50.clk_in
add_interface csense_adc_fo conduit end
set_interface_property csense_adc_fo EXPORT_OF csense_adc_fo.external_connection
add_interface csense_cs_n conduit end
set_interface_property csense_cs_n EXPORT_OF csense_cs_n.external_connection
add_interface csense_sck conduit end
set_interface_property csense_sck EXPORT_OF csense_sck.external_connection
add_interface csense_sdi conduit end
set_interface_property csense_sdi EXPORT_OF csense_sdi.external_connection
add_interface csense_sdo conduit end
set_interface_property csense_sdo EXPORT_OF csense_sdo.external_connection
add_interface dip conduit end
set_interface_property dip EXPORT_OF pio_DIP.external_connection
add_interface eth_rst conduit end
set_interface_property eth_rst EXPORT_OF pio_RST_ETH.external_connection
add_interface ext conduit end
set_interface_property ext EXPORT_OF pio_EXT.external_connection
add_interface ftdi conduit end
set_interface_property ftdi EXPORT_OF FTDI_0.FTDI_conduit_end
add_interface led_de4 conduit end
set_interface_property led_de4 EXPORT_OF pio_LED.external_connection
add_interface led_painel conduit end
set_interface_property led_painel EXPORT_OF pio_LED_painel.external_connection
add_interface m1_ddr2_i2c_scl conduit end
set_interface_property m1_ddr2_i2c_scl EXPORT_OF m1_ddr2_i2c_scl.external_connection
add_interface m1_ddr2_i2c_sda conduit end
set_interface_property m1_ddr2_i2c_sda EXPORT_OF m1_ddr2_i2c_sda.external_connection
add_interface m1_ddr2_memory conduit end
set_interface_property m1_ddr2_memory EXPORT_OF m1_ddr2_memory.memory
add_interface m1_ddr2_memory_pll_ref_clk clock sink
set_interface_property m1_ddr2_memory_pll_ref_clk EXPORT_OF m1_ddr2_memory.pll_ref_clk
add_interface m1_ddr2_memory_status conduit end
set_interface_property m1_ddr2_memory_status EXPORT_OF m1_ddr2_memory.status
add_interface m1_ddr2_oct conduit end
set_interface_property m1_ddr2_oct EXPORT_OF m1_ddr2_memory.oct
add_interface m2_ddr2_i2c_scl conduit end
set_interface_property m2_ddr2_i2c_scl EXPORT_OF m2_ddr2_i2c_scl.external_connection
add_interface m2_ddr2_i2c_sda conduit end
set_interface_property m2_ddr2_i2c_sda EXPORT_OF m2_ddr2_i2c_sda.external_connection
add_interface m2_ddr2_memory conduit end
set_interface_property m2_ddr2_memory EXPORT_OF m2_ddr2_memory.memory
add_interface m2_ddr2_memory_dll_sharing conduit end
set_interface_property m2_ddr2_memory_dll_sharing EXPORT_OF m2_ddr2_memory.dll_sharing
add_interface m2_ddr2_memory_pll_sharing conduit end
set_interface_property m2_ddr2_memory_pll_sharing EXPORT_OF m2_ddr2_memory.pll_sharing
add_interface m2_ddr2_memory_status conduit end
set_interface_property m2_ddr2_memory_status EXPORT_OF m2_ddr2_memory.status
add_interface m2_ddr2_oct conduit end
set_interface_property m2_ddr2_oct EXPORT_OF m2_ddr2_memory.oct
add_interface rst reset sink
set_interface_property rst EXPORT_OF clk_50.clk_in_reset
add_interface sd_clk conduit end
set_interface_property sd_clk EXPORT_OF sd_clk.external_connection
add_interface sd_cmd conduit end
set_interface_property sd_cmd EXPORT_OF sd_cmd.external_connection
add_interface sd_dat conduit end
set_interface_property sd_dat EXPORT_OF sd_dat.external_connection
add_interface sd_wp_n conduit end
set_interface_property sd_wp_n EXPORT_OF sd_wp_n.external_connection
add_interface ssdp conduit end
set_interface_property ssdp EXPORT_OF SEVEN_SEGMENT_CONTROLLER_0.SSDP_conduit
add_interface temp_scl conduit end
set_interface_property temp_scl EXPORT_OF temp_scl.external_connection
add_interface temp_sda conduit end
set_interface_property temp_sda EXPORT_OF temp_sda.external_connection
add_interface timer_1ms_external_port conduit end
set_interface_property timer_1ms_external_port EXPORT_OF timer_1ms.external_port
add_interface timer_1us_external_port conduit end
set_interface_property timer_1us_external_port EXPORT_OF timer_1us.external_port
add_interface tristate_conduit conduit end
set_interface_property tristate_conduit EXPORT_OF tristate_conduit_bridge_0.out
add_interface tse_clk clock sink
set_interface_property tse_clk EXPORT_OF tse_mac.pcs_ref_clk_clock_connection
add_interface tse_led conduit end
set_interface_property tse_led EXPORT_OF tse_mac.status_led_connection
add_interface tse_mac_mac_misc_connection conduit end
set_interface_property tse_mac_mac_misc_connection EXPORT_OF tse_mac.mac_misc_connection
add_interface tse_mac_serdes_control_connection conduit end
set_interface_property tse_mac_serdes_control_connection EXPORT_OF tse_mac.serdes_control_connection
add_interface tse_mdio conduit end
set_interface_property tse_mdio EXPORT_OF tse_mac.mac_mdio_connection
add_interface tse_serial conduit end
set_interface_property tse_serial EXPORT_OF tse_mac.serial_connection

set_interconnect_requirement {$system} qsys_mm.clockCrossingAdapter HANDSHAKE
set_interconnect_requirement {$system} qsys_mm.insertDefaultSlave FALSE
set_interconnect_requirement {$system} qsys_mm.maxAdditionalLatency 1

save_system MebX_Qsys_Project.qsys
